# EAGLE schematic basic_attiny84 (EAGLE 9.6.2)
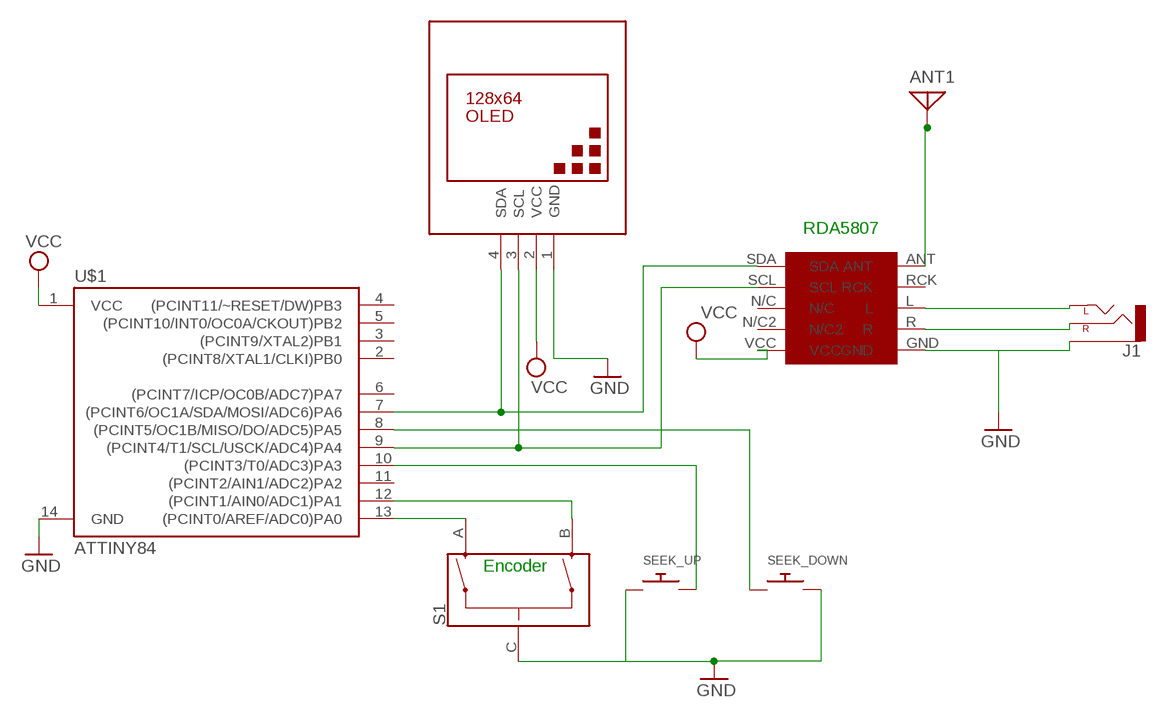
[diagram p0: schematic, sheet 1]

## Parts
ANT1  ANTENNA  [PAD-01]
J1  AUDIO_JACK_2.5MMSPECIAL_POGO_PINS  [STEREOJACK2.5MM_SPECIAL_POGOPINS]
S1  ENCODER  [ENCODER-16MM-QUAD]
SEEK_DOWN  SWITCH_PUSHBUTTONC&K_KSS  [BTN_CK_KSS]
SEEK_UP  SWITCH_PUSHBUTTONC&K_KSS  [BTN_CK_KSS]
U$1  ATTINY84  [SO14]
U$2  RDA  [RDA]
U$3  DISPLAY-OLED-128X64-I2C  [DISPLAY-OLED-128X64-I2C]

## Nets
GND: J1.RING1(SLEEVE) S1.C SEEK_DOWN.P$2 SEEK_UP.P$1 U$1.14(GND) U$2.GND U$3.1(GND)
N$1: U$1.7((PCINT6/OC1A/SDA/MOSI/ADC6)PA6) U$2.SDA U$3.4(SDA)
N$2: U$1.9((PCINT4/T1/SCL/USCK/ADC4)PA4) U$2.SCL U$3.3(SCL)
N$3: J1.SHIELD(LEFT) U$2.L
N$4: J1.TIP(RIGHT) U$2.R
N$5: ANT1.1 U$2.ANT
N$6: SEEK_UP.P$2 U$1.10((PCINT3/T0/ADC3)PA3)
N$7: S1.A U$1.13((PCINT0/AREF/ADC0)PA0)
N$8: SEEK_DOWN.P$1 U$1.8((PCINT5/OC1B/MISO/DO/ADC5)PA5)
N$9: S1.B U$1.12((PCINT1/AIN0/ADC1)PA1)
VCC: U$1.1(VCC) U$2.VCC U$3.2(VCC)
Unconnected: U$1.2((PCINT8/XTAL1/CLKI)PB0) U$1.3((PCINT9/XTAL2)PB1) U$1.4((PCINT11/~RESET/DW)PB3) U$1.5((PCINT10/INT0/OC0A/CKOUT)PB2) U$1.6((PCINT7/ICP/OC0B/ADC7)PA7) U$1.11((PCINT2/AIN1/ADC2)PA2) U$2.N/C U$2.N/C2 U$2.RCK

## Notes on the sheet
- RDA5807
- Encoder

## Library data of the parts
ANT1 = discrete:ANTENNA: Antenna
J1 = SparkFun-Connectors:AUDIO_JACK_2.5MM: Audio Jack 2.5mm variants of PTH and SMT audio jacks. SparkFun Products: SparkFun PicoBoard <https://www.sparkfun.com/products/11888>- 2.5mm SMD
S1 = SparkFun-Switches:ENCODER: Rotary Encoder Encoders rotate similarly to potentiometers, but they’re different from potentiometers in that an encoder has full rotation without limits. They output gray code so that you can tell how much and in which direction the encoder has been turned. SparkFun Products Used on the https://www.sparkfun.com/products/11043 (COM-11043); PROD_ID: RES-11299
SEEK_DOWN SEEK_UP = adafruit:SWITCH_PUSHBUTTON: Buttons SOFTTOUCHSMD_SJ - Soft touch temporary push button (Super Junk Akihabara) Compatible with SKPMANE010 [Mouser: 688-SKPMAN] C&K_KSS = Digikey: KSS221GLFS
U$1 = SparkFun-IC-Microcontroller:ATTINY84: Atmel 14-pin 2/4/8kB flash uC Datasheet <https://cdn.sparkfun.com/datasheets/Widgets/doc8006.pdf> SparkFun Products Tiny AVR Programmer <https://www.sparkfun.com/products/11801> (PGM-11801) SparkFun Servo Trigger - Continuous Rotation <https://www.sparkfun.com/products/13872> (WIG-13872) SparkFun Servo Trigger <https://www.sparkfun.com/products/13118> (WIG-13118); PROD_ID: IC-11285
U$2 = RDA:RDA
U$3 = diy-modules:DISPLAY-OLED-128X64-I2C: 128x64 Dot Matrix OLED Module based on SSD1306 chip Variant with I2C interface More details available here: http://www.instructables.com/id/Monochrome-096-i2c-OLED-display-with-arduino-SSD13/ SSD1306 datasheet: https://cdn-shop.adafruit.com/datasheets/SSD1306.pdf Click here to find device on ebay.com <http://www.ebay.com/sch/oled+display+128x64+iic> Note: There are two variants: I2C and SPI. Search for the proper version.